# EAGLE schematic do_an_1 (EAGLE 8.6.3)
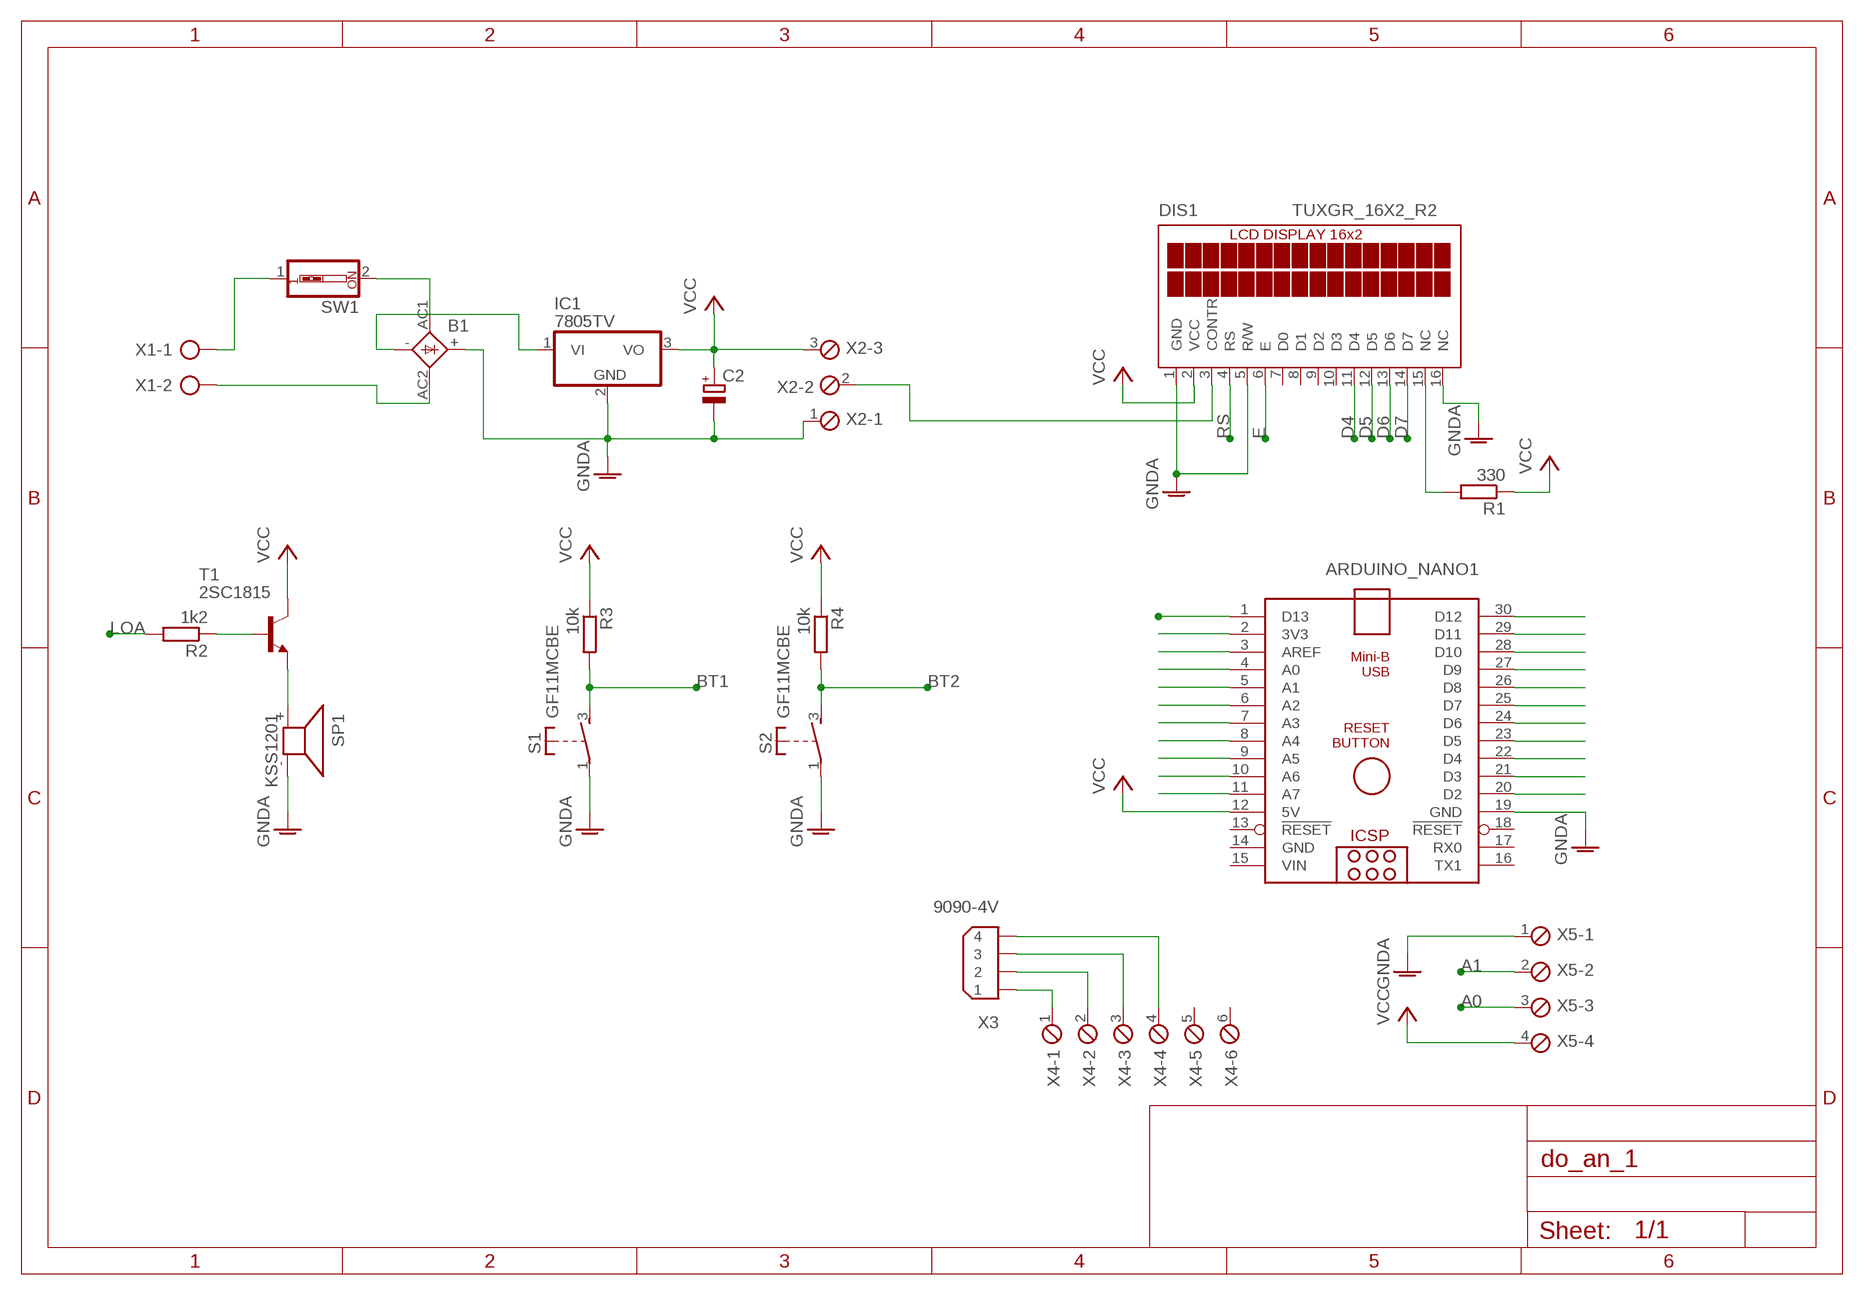
[diagram p0: schematic, sheet 1]

## Parts
ARDUINO_NANO1  ARDUINO_NANO  [ARDUINO_NANO]
B1  2KBB-R  [2KBB-R]
C2  CPOL-EUE5-10.5  [E5-10,5]
DIS1  TUXGR_16X2_R2  [TUXGR_16X2_R2]
IC1  7805TV  [TO220V]
R1  330  R-EU_0207/10  [0207/10]
R2  1k2  R-EU_0207/10  [0207/10]
R3  10k  R-EU_0207/10  [0207/10]
R4  10k  R-EU_0207/10  [0207/10]
S1  GF11MCBE  [GP11MCBE]
S2  GF11MCBE  [GP11MCBE]
SP1  KSS1201  [KSS1201]
SW1  SW_DIP-1  [EDG-01]
T1  2SC1815  [TO92-ECB]
X1  AK300/2  [AK300/2]
X2  MPT3  [3POL254]
X3  9090-4V  [9090-4V]
X4  MPT6  [6POL254]
X5  MPT4  [4POL254]

## Nets
A0: X5.3
A1: X5.2
AAA: ARDUINO_NANO1.2(3V3)
ALERT: ARDUINO_NANO1.1(D13)
BT1: R3.2 S1.3(S)
BT2: R4.2 S2.3(S)
D4: DIS1.11(D4)
D5: DIS1.12(D5)
D6: DIS1.13(D6)
D7: DIS1.14(D7)
E: DIS1.6(E)
GNDA: ARDUINO_NANO1.19(GND) B1.+ C2.- DIS1.1(GND) DIS1.5(R/W) DIS1.16(NC) IC1.2(GND) S1.1(P) S2.1(P) SP1.- X2.1 X5.1
LCD_D4: ARDUINO_NANO1.20(D2)
LCD_D6: ARDUINO_NANO1.22(D4)
LOA: R2.2
N$1: R2.1 T1.B
N$2: B1.AC1 SW1.2
N$3: B1.AC2 X1.2
N$4: B1.- IC1.1(VI)
N$5: DIS1.3(CONTR) X2.2
N$6: DIS1.15(NC) R1.2
N$7: X3.1 X4.1
N$8: X3.2 X4.2
N$9: SP1.+ T1.E
N$10: ARDUINO_NANO1.6(A2)
N$11: X3.3 X4.3
N$12: X3.4 X4.4
N$13: ARDUINO_NANO1.7(A3)
N$14: SW1.1 X1.1
N$15: ARDUINO_NANO1.8(A4)
N$16: ARDUINO_NANO1.9(A5)
N$17: ARDUINO_NANO1.10(A6)
N$18: ARDUINO_NANO1.11(A7)
N$19: ARDUINO_NANO1.24(D6)
N$20: ARDUINO_NANO1.30(D12)
N$21: ARDUINO_NANO1.3(AREF)
N$24: ARDUINO_NANO1.29(D11)
N$25: ARDUINO_NANO1.28(D10)
N$26: ARDUINO_NANO1.27(D9)
N$27: ARDUINO_NANO1.26(D8)
N$28: ARDUINO_NANO1.25(D7)
N$29: ARDUINO_NANO1.23(D5)
N$30: ARDUINO_NANO1.21(D3)
N$32: ARDUINO_NANO1.4(A0)
N$33: ARDUINO_NANO1.5(A1)
RS: DIS1.4(RS)
VCC: ARDUINO_NANO1.12(5V) C2.+ DIS1.2(VCC) IC1.3(VO) R1.1 R3.1 R4.1 T1.C X2.3 X5.4
Unconnected: ARDUINO_NANO1.13(!RESET) ARDUINO_NANO1.16(TX1) ARDUINO_NANO1.17(RX0) ARDUINO_NANO1.18(!RESET) DIS1.7(D0) DIS1.8(D1) DIS1.9(D2) DIS1.10(D3) X4.5 X4.6

## Power pins joined to a net without a drawn wire
GND: ARDUINO_NANO1.14(GND)
VIN: ARDUINO_NANO1.15(VIN)

## Library data of the parts
ARDUINO_NANO1 = ArduinoNanoV30:ARDUINO_NANO: Arduino Nano V3.0 Overview: The Arduino Nano is a small, complete, and breadboard-friendly board based on the ATmega328 (Arduino Nano 3.x) or ATmega168 (Arduino Nano 2.x). It has more or less the same functionality of the Arduino Duemilanove, but in a different package. It lacks only a DC power jack, and works with a Mini-B USB cable instead of a standard one. The Nano was designed and is being produced by Gravitech. Specifications: Microcontroller Atmel ATmega168 or ATmega328 Operating Voltage (logic level) 5 V Input Voltage (recommended) 7-12 V Input Voltage (limits) 6-20 V Digital I/O Pins 14 (of which 6 provide PWM output) Analog Input Pins 8 DC Current per I/O Pin 40 mA Flash Memory 16 KB (ATmega168) or 32 KB (ATmega328) of which 2 KB used by bootloader SRAM 1 KB (ATmega168) or 2 KB (ATmega328) EEPROM 512 bytes (ATmega168) or 1 KB (ATmega328) Clock Speed 16 MHz Dimensions 0.73" x 1.70" Length 45 mm Width 18 mm Weigth 5 g Power: The Arduino Nano can be powered via the Mini-B USB connection, 6-20V unregulated external power supply (pin 30), or 5V regulated external power supply (pin 27). The power source is automatically selected to the highest voltage source. Memory: The ATmega168 has 16 KB of flash memory for storing code (of which 2 KB is used for the bootloader); the ATmega328 has 32 KB, (also with 2 KB used for the bootloader). The ATmega168 has 1 KB of SRAM and 512 bytes of EEPROM (which can be read and written with the EEPROM library); the ATmega328 has 2 KB of SRAM and 1 KB of EEPROM. Input and Output: Each of the 14 digital pins on the Nano can be used as an input or output, using pinMode(), digitalWrite(), and digitalRead() functions. They operate at 5 volts. Each pin can provide or receive a maximum of 40 mA and has an internal pull-up resistor (disconnected by default) of 20-50 kOhms. In addition, some pins have specialized functions. Visit Arduino - ArduinoBoardNano <https://www.arduino.cc/en/Main/ArduinoBoardNano>
B1 = rectifier:2KBB-R: RECTIFIER grid 3 x 5 mm
C2 = rcl:CPOL-EU: POLARIZED CAPACITOR, European symbol; SPICEPREFIX: C
DIS1 = display-lcd:TUXGR_16X2_R2: Tuxgraphics LCD display 16x2 characters reflective, without background light Source: tuxgr_12x2_r2.pdf; OC_FARNELL: unknown; OC_NEWARK: unknown
IC1 = linear:78*: Positive VOLTAGE REGULATOR Source: http://cache.national.com/ds/LM/LM78L05.pdf http://www.fairchildsemi.com/ds/LM/LM7805.pdf
R1-R4 = rcl:R-EU_: RESISTOR, European symbol; SPICEPREFIX: R
S1 S2 = gp_10:GF11?BE: GP Series Sealed Ultraminiature Pushbutton Switches Source: http://www.ck-components.com/13343/gp_12feb13.pdf/; MF: C&K Components; MPN: GF11MCBE; OC_FARNELL: unknown; OC_NEWARK: 39M9588
SP1 = buzzer:KSS1201: SPEAKER Source: Schukat; OC_FARNELL: unknown; OC_NEWARK: unknown
SW1 = special:SW_DIP-1: DIP SWITCH
T1 = transistor:2SC1815: NPN EPITAXIAL TRANSISTOR Source: TOSHIBA .. 2SC1815 1.pdf
X1 = con-ptr500:AK300/2: CONNECTOR; OC_FARNELL: unknown; OC_NEWARK: unknown
X2 = con-phoenix-254:MPT3: PHOENIX CONNECTOR; OC_FARNELL: unknown; OC_NEWARK: unknown
X3 = con-thomas-betts:9090-4: Disk Drive Power four position Source: Thomas & Betts Electronic Interconnects Eiropean Edition 1998; OC_FARNELL: unknown; OC_NEWARK: unknown
X4 = con-phoenix-254:MPT6: PHOENIX CONNECTOR; OC_FARNELL: unknown; OC_NEWARK: unknown
X5 = con-phoenix-254:MPT4: PHOENIX CONNECTOR; OC_FARNELL: unknown; OC_NEWARK: unknown